# EAGLE design schema (EAGLE 9.6.1)
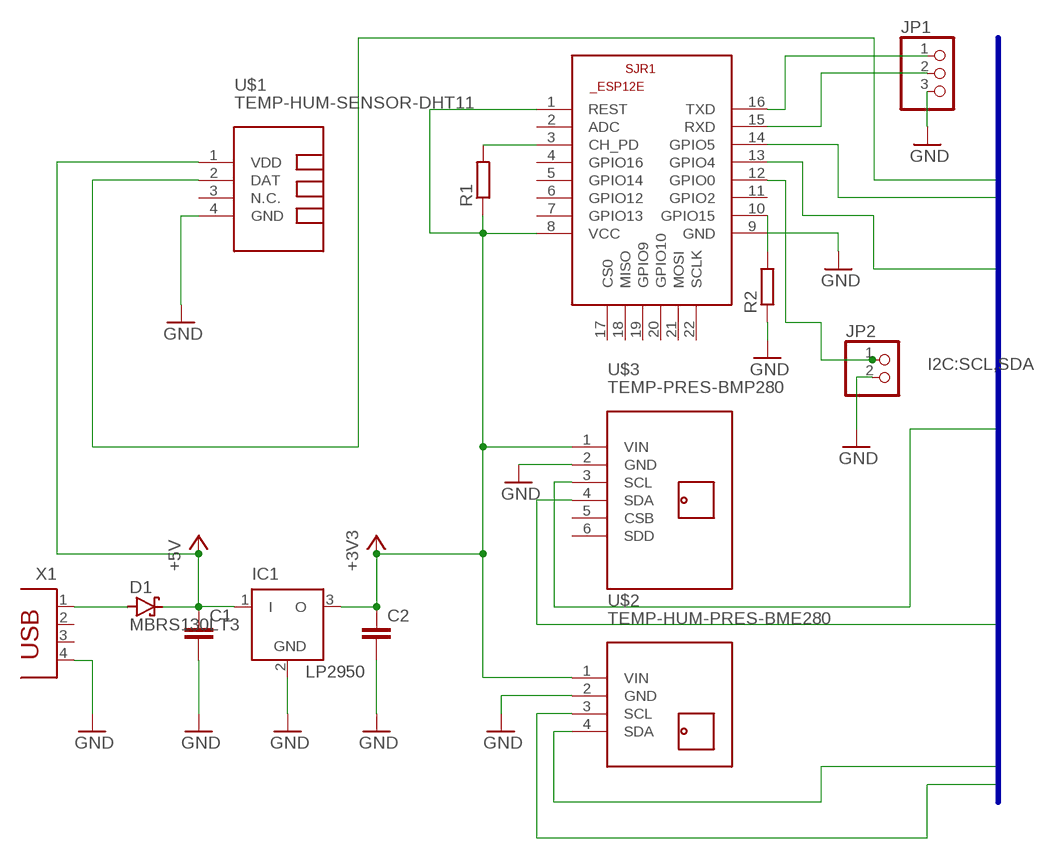
[diagram p0: schematic, sheet 1]

## Parts
C1  C-EUC0603  [C0603]
C2  C-EUC0603  [C0603]
D1  MBRS130LT3  [SMB]
IC1  LP2950  [DPACK]
JP1  PINHD-1X3  [1X03]
JP2  PINHD-1X2  [1X02]
R1  R-EU_R0603  [R0603]
R2  R-EU_R0603  [R0603]
SJR1  ESP8266-12EESP12E  [ESP8266-ESP12E]
U$1  TEMP-HUM-SENSOR-DHT11  [TEMP-HUM-SENSOR-DHT11]
U$2  TEMP-HUM-PRES-BME280  [TEMP-HUM-PRES-BME280]
U$3  TEMP-PRES-BMP280  [TEMP-PRES-BMP280]
X1  PN61729  [PN61729]

## Nets
+3V3: C2.1 IC1.3(O) R1.1 SJR1.1(REST) SJR1.8(VCC) U$2.1(VIN) U$3.1(VIN)
+5V: C1.1 D1.C IC1.1(I) U$1.1(VDD)
GND: C1.2 C2.2 IC1.2(GND) JP1.3 JP2.2 R2.1 SJR1.9(GND) U$1.4(GND) U$2.2(GND) U$3.2(GND) X1.4
N$1: R1.2 SJR1.3(CH_PD)
N$2: JP2.1 SJR1.12(GPIO0)
N$3: D1.A X1.1
N$4: JP1.1 SJR1.16(TXD)
N$5: JP1.2 SJR1.15(RXD)
N$7: R2.2 SJR1.10(GPIO15)
SCL: SJR1.14(GPIO5) U$2.3(SCL) U$3.3(SCL)
SDA: SJR1.13(GPIO4) U$1.2(DAT) U$2.4(SDA) U$3.4(SDA)
Unconnected: SJR1.2(ADC) SJR1.4(GPIO16) SJR1.5(GPIO14) SJR1.6(GPIO12) SJR1.7(GPIO13) SJR1.11(GPIO2) SJR1.17(CS0) SJR1.18(MISO) SJR1.19(GPIO9) SJR1.20(GPIO10) SJR1.21(MOSI) SJR1.22(SCLK) U$1.3(N.C.) U$3.5(CSB) U$3.6(SDD) X1.2 X1.3

## Buses
I2C:SCL,SDA

## Library data of the parts
C1 C2 = rcl:C-EU: CAPACITOR, European symbol; SPICEPREFIX: C
D1 = diode:MBRS130LT3: Schottky Power Rectifier Source: http://www.onsemi.com/pub/Collateral/MBRS130LT3-D.PDF
IC1 = linear:LP2950: 100 mA, Low Power Low Dropout Voltage Regulator Source: http://www.onsemi.com/pub/Collateral/LP2950-D.PDF
JP1 = pinhead:PINHD-1X3: PIN HEADER
JP2 = pinhead:PINHD-1X2: PIN HEADER
R1 R2 = rcl:R-EU_: RESISTOR, European symbol; SPICEPREFIX: R
SJR1 = esp12e:ESP8266-12E: ESP8266-12E Library for Eagle CAD The author not responsible for any damages or errors!. Created by Suhail jr.lt;/author>
U$1 = diy-modules:TEMP-HUM-SENSOR-DHT11: DHT11 - digital humidity & temperature sensor DHT11 datasheet available here: https://akizukidenshi.com/download/ds/aosong/DHT11.pdf Click here to find device on ebay.com <http://www.ebay.com/sch/dht11+digital+sensor>
U$2 = diy-modules:TEMP-HUM-PRES-BME280: Digital Humidity-Temperature-Pressure Sensor based on BME280 device More information about BME280 device is available here: https://www.bosch-sensortec.com/bst/products/all_products/bme280 Click here to find device on ebay.com <http://www.ebay.com/sch/bme280+breakout>
U$3 = diy-modules:TEMP-PRES-BMP280
X1 = con-berg:PN61729: BERG USB connector; OC_FARNELL: unknown; OC_NEWARK: unknown

## Module GROUND
Ports: 

### Library data of the parts

## Board
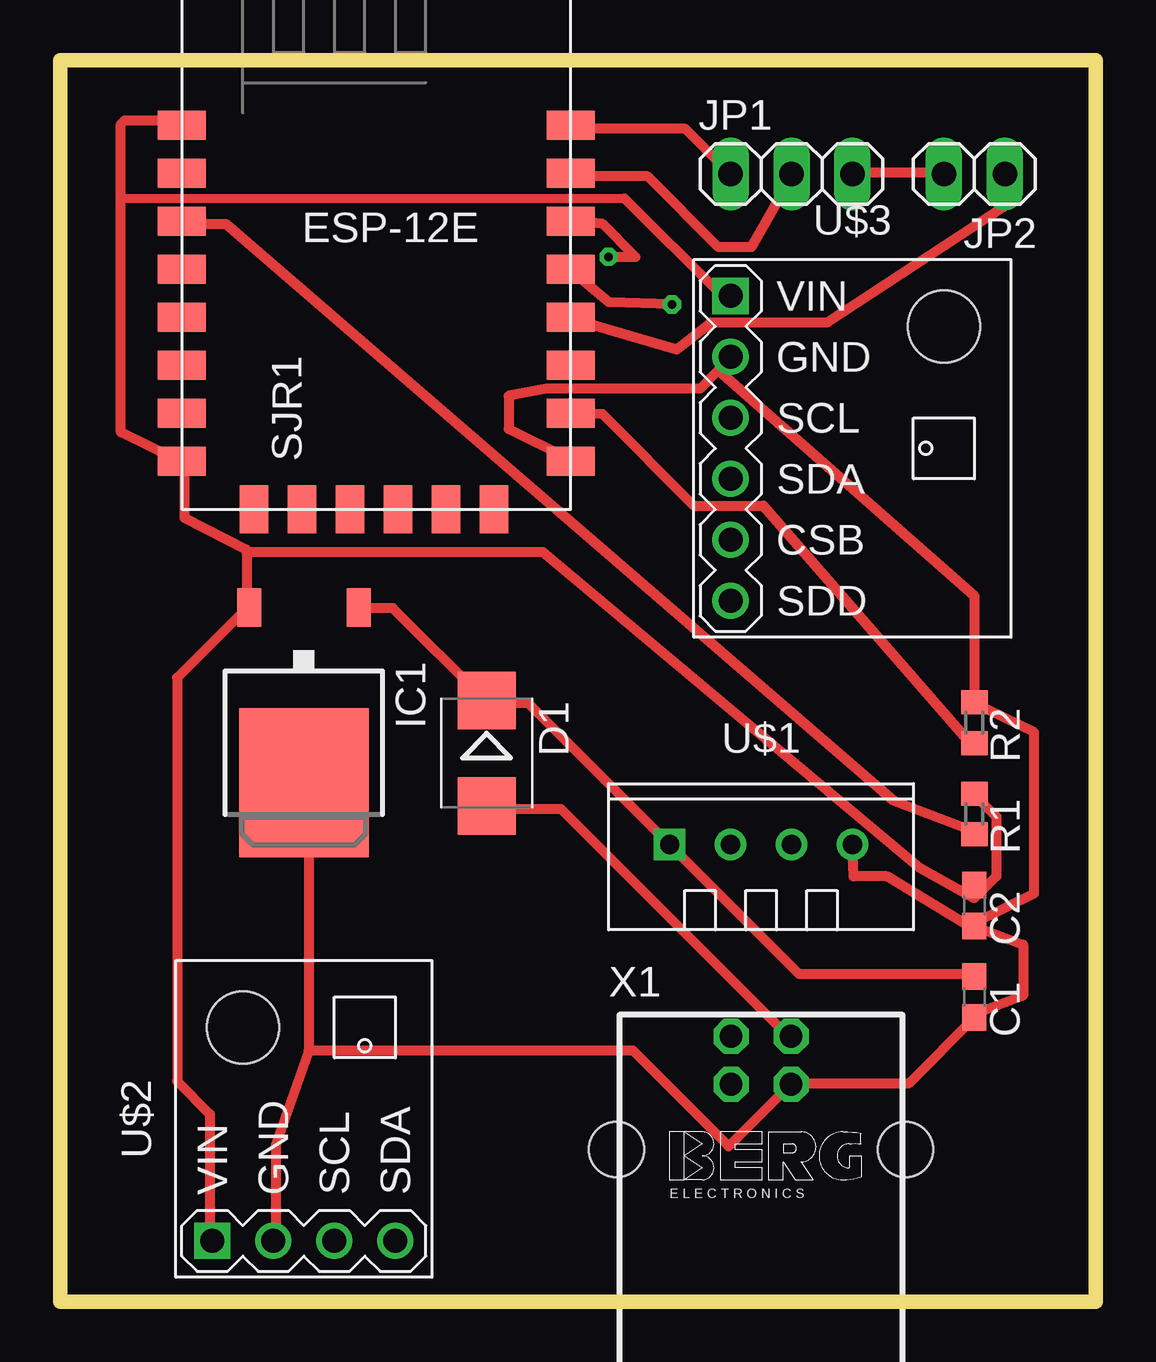
[diagram p1: board, top side]
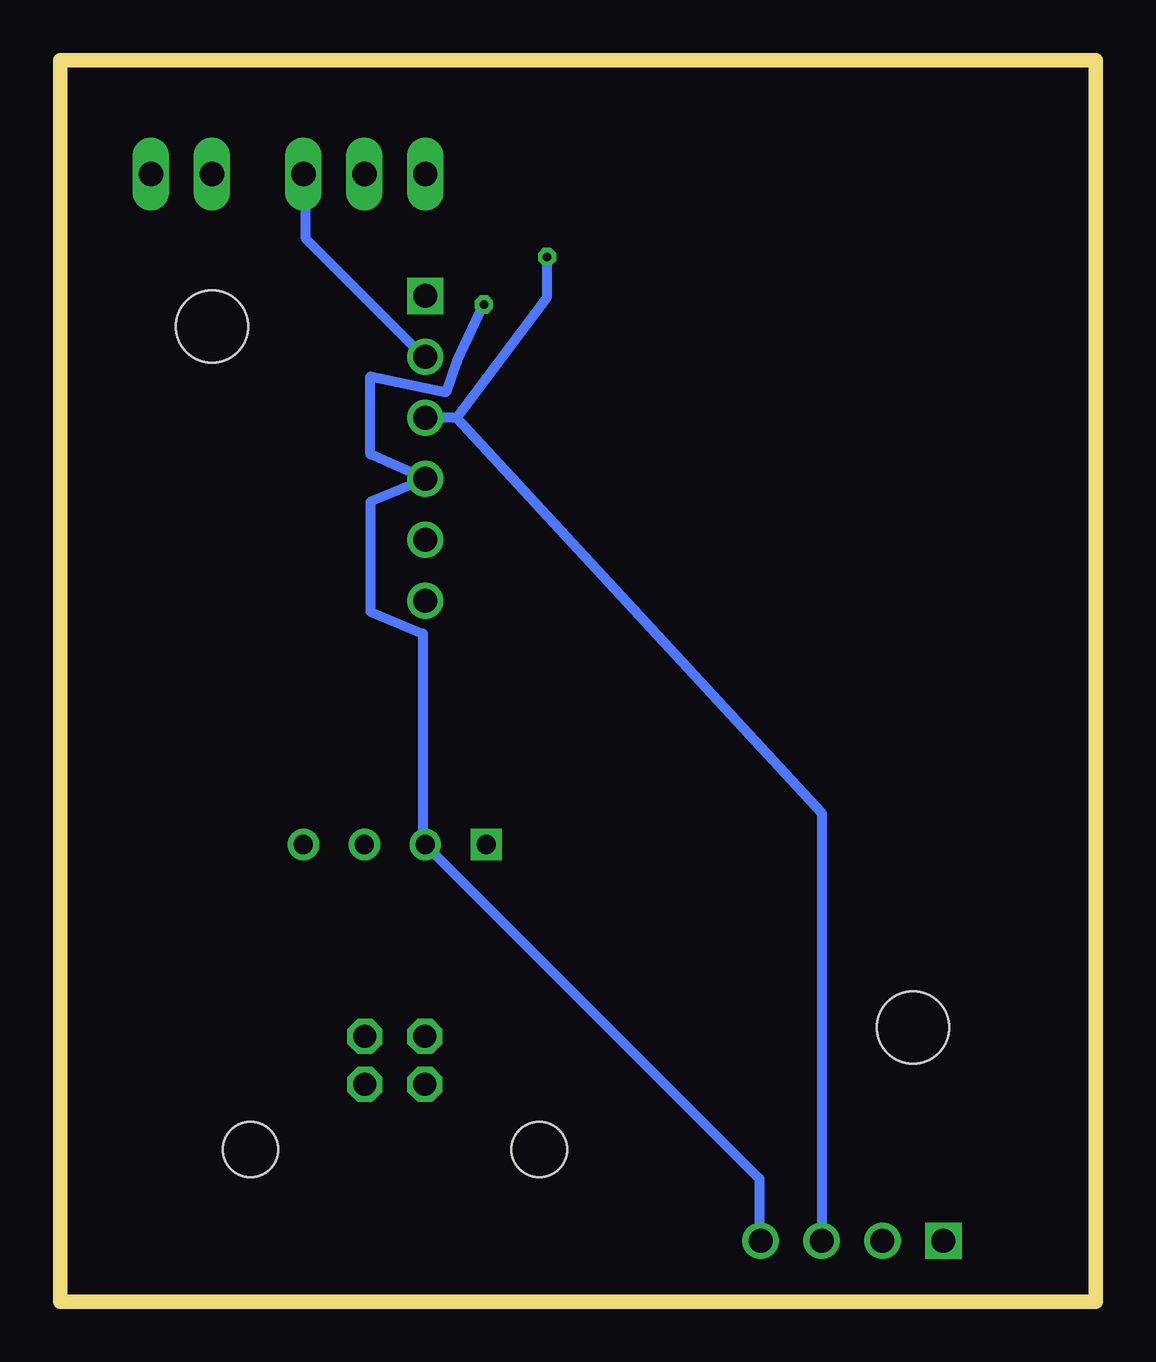
[diagram p2: board, bottom side, seen from below]

Size 43.16 x 51.74 mm. Coordinates in mm from the lower left corner, seen from the top.
Outline: 0,0 43.16,0 43.16,51.74 0,51.74 0,0
Copper layers (1*16): Top 0.035mm / dielectric 1.5mm / Bottom 0.035mm
Design rules "default": minimum track width 6mil, minimum drill 0.35mm, track to track 6mil, track to pad 6mil, pad to pad 6mil, via to via 6mil, smd to smd 6mil, copper to edge 40mil, drill to drill 6mil, minimum pad ring 10mil, minimum via ring 8mil, stop-mask expansion 4mil, vias tented up to drill 0mil, thermal gap 10mil

### Footprints (pad centres in the part's own frame; a part is rotated, then mirrored left to right if it is on the bottom)
C0603 = smd 1.1 x 1: 1 -0.85,0; 2 0.85,0
SMB = smd 2.4 x 2.4: A 2.2,0; C -2.2,0
DPACK = smd 1 x 1.6: 1 -2.28,-4.8; 3 2.28,-4.8 | smd 5.4 x 6.2: 2 0,2.5
1X03 = drill 1.016 long: 1 -2.54,0; 2 0,0; 3 2.54,0
1X02 = drill 1.016 long: 1 -1.27,0; 2 1.27,0
R0603 = smd 1 x 1.1: 1 -0.85,0; 2 0.85,0
ESP8266-ESP12E = smd 2 x 1.2: 1 -7.62,5.84; 2 -7.62,3.84; 3 -7.62,1.84; 4 -7.62,-0.16; 5 -7.62,-2.16; 6 -7.62,-4.16; 7 -7.62,-6.16; 8 -7.62,-8.16; 9 8.58,-8.16; 10 8.58,-6.16; 11 8.58,-4.16; 12 8.58,-2.16; 13 8.58,-0.16; 14 8.58,1.84; 15 8.58,3.84; 16 8.58,5.84 | smd 1.2 x 2: 17 -4.62,-10.16; 18 -2.62,-10.16; 19 -0.62,-10.16; 20 1.38,-10.16; 21 3.38,-10.16; 22 5.38,-10.16
TEMP-HUM-SENSOR-DHT11 = drill 0.8 square: 1 -3.81,0 | drill 0.8: 2 -1.27,0; 3 1.27,0; 4 3.81,0
TEMP-HUM-PRES-BME280 = drill 1 square: 1 -5.08,3.81 | drill 1: 2 -5.08,1.27; 3 -5.08,-1.27; 4 -5.08,-3.81 | hole 3: 3.81,2.54
TEMP-PRES-BMP280 = drill 1 square: 1 -5.08,3.81 | drill 1: 2 -5.08,1.27; 3 -5.08,-1.27; 4 -5.08,-3.81; 5 -5.08,-6.35; 6 -5.08,-8.89 | hole 3: 3.81,2.54
PN61729 = drill 0.95 octagon: 1 1.25,4.71; 2 -1.25,4.71; 3 -1.25,2.71; 4 1.25,2.71 | hole 2.3: -6.02,0; 6.02,0

### Placement (x,y rotation side)
C1  38.1,12.7 270 top
C2  38.1,16.51 270 top
D1  17.78,22.86 270 top
IC1  10.16,24.13 180 top
JP1  30.48,46.99 0 top
JP2  38.1,46.99 180 top
R1  38.1,20.32 270 top
R2  38.1,24.13 270 top
SJR1  12.7,43.18 0 top
U$1  29.21,19.05 0 top
U$2  10.16,7.62 90 top
U$3  33.02,38.1 0 top
X1  29.21,6.35 0 top

### Tracks (layer width: path | path; a pad name or v marks a point on that pad's centre or on a via)
+3V3
  Top 0.381: 2.54,45.97 23.52,45.97
  Top 0.406: 38.1,16.82 C2.1 | 38.1,16.82 39.01,17.73 39.01,20.22 38.1,21.13 R1.1 | 7.77,31.24 7.77,31.34 5.18,32.66 5.18,35 SJR1.8 5.03,35 2.54,36.22 2.54,45.97 2.54,49.07 2.69,49.23 4.12,49.23 5.03,48.87 SJR1.1 | 7.77,31.24 7.77,29.06 IC1.3 7.77,28.91 4.88,26.01 4.88,9.2 6.25,7.82 6.25,2.54 U$2.1 | 38.1,16.82 35.81,18.09 20.12,31.24 7.77,31.24 | 23.52,45.97 27.48,42.01 27.89,42.01 U$3.1
+5V
  Top 0.406: IC1.1 12.5,28.91 13.87,28.91 17.68,25.1 D1.C 17.83,24.94 19.51,24.94 U$1.1 30.79,13.66 38.1,13.66 C1.1
GND
  Top 0.406: 10.36,10.47 8.99,6.55 8.99,2.54 U$2.2 | 10.36,10.47 10.36,21.44 10.21,21.59 IC1.2 | 38.1,15.8 40.59,17.02 40.59,23.72 38.1,24.94 R2.1 38.1,29.41 27.43,38.81 | 38.1,15.8 37.64,15.8 34.44,17.73 33.07,17.73 U$1.4 | 38.1,15.8 C2.2 38.1,15.65 40.13,14.88 40.13,12.75 38.1,11.99 C1.2 38.1,11.84 35.36,9.09 30.48,9.09 X1.4 30.33,8.94 27.86,6.48 23.88,10.47 10.36,10.47 | JP1.3 33.07,47.04 36.73,47.04 JP2.2 | 27.43,38.81 27.89,39.27 U$3.2 | 27.43,38.81 26.67,38.05 20.27,38.05 18.69,37.74 18.69,36.37 21.18,35.15 SJR1.9
  Bottom 0.406: JP1.3 32.92,46.89 32.92,44.3 28.04,39.42 U$3.2
N$1
  Top 0.406: R1.2 38.1,19.61 34.75,20.88 6.91,44.91 5.18,44.91 SJR1.3
N$2
  Top 0.406: SJR1.12 21.34,40.95 25.71,39.68 27.13,40.79 31.95,40.79 39.32,45.62 JP2.1
N$3
  Top 0.406: D1.A 17.83,20.52 20.88,20.52 30.33,11.07 X1.1
N$4
  Top 0.406: JP1.1 26.06,48.87 21.34,48.87 SJR1.16
N$5
  Top 0.406: SJR1.15 21.34,46.89 24.49,46.89 27.43,43.94 28.8,43.94 30.48,46.89 JP1.2
N$7
  Top 0.406: R2.2 38.1,23.42 37.79,23.42 29.31,33.17 26.42,33.17 22.61,36.98 SJR1.10
SCL  (via drill 0.35)
  Top 0.406: v22.86,43.54 23.98,43.54 22.61,44.91 SJR1.14
  Bottom 0.406: v22.86,43.54 22.86,41.86 26.62,36.83 | U$2.3 11.43,20.37 26.62,36.83 | 26.62,36.83 U$3.3
SDA  (via drill 0.35)
  Top 0.406: v25.5,41.55 22.86,41.66 21.34,42.93 SJR1.13
  Bottom 0.406: v25.5,41.55 26.62,39.17 27.08,37.9 30.23,38.56 30.23,35.31 U$3.4 28.04,34.24 30.23,33.32 30.23,28.75 28.04,27.84 28.04,19.15 U$1.2 14.02,5.13 14.02,2.54 U$2.4